# Altium schematic sheet Sheet2.SchDoc
size A3; SheetNumber: 1; SheetTotal: 2
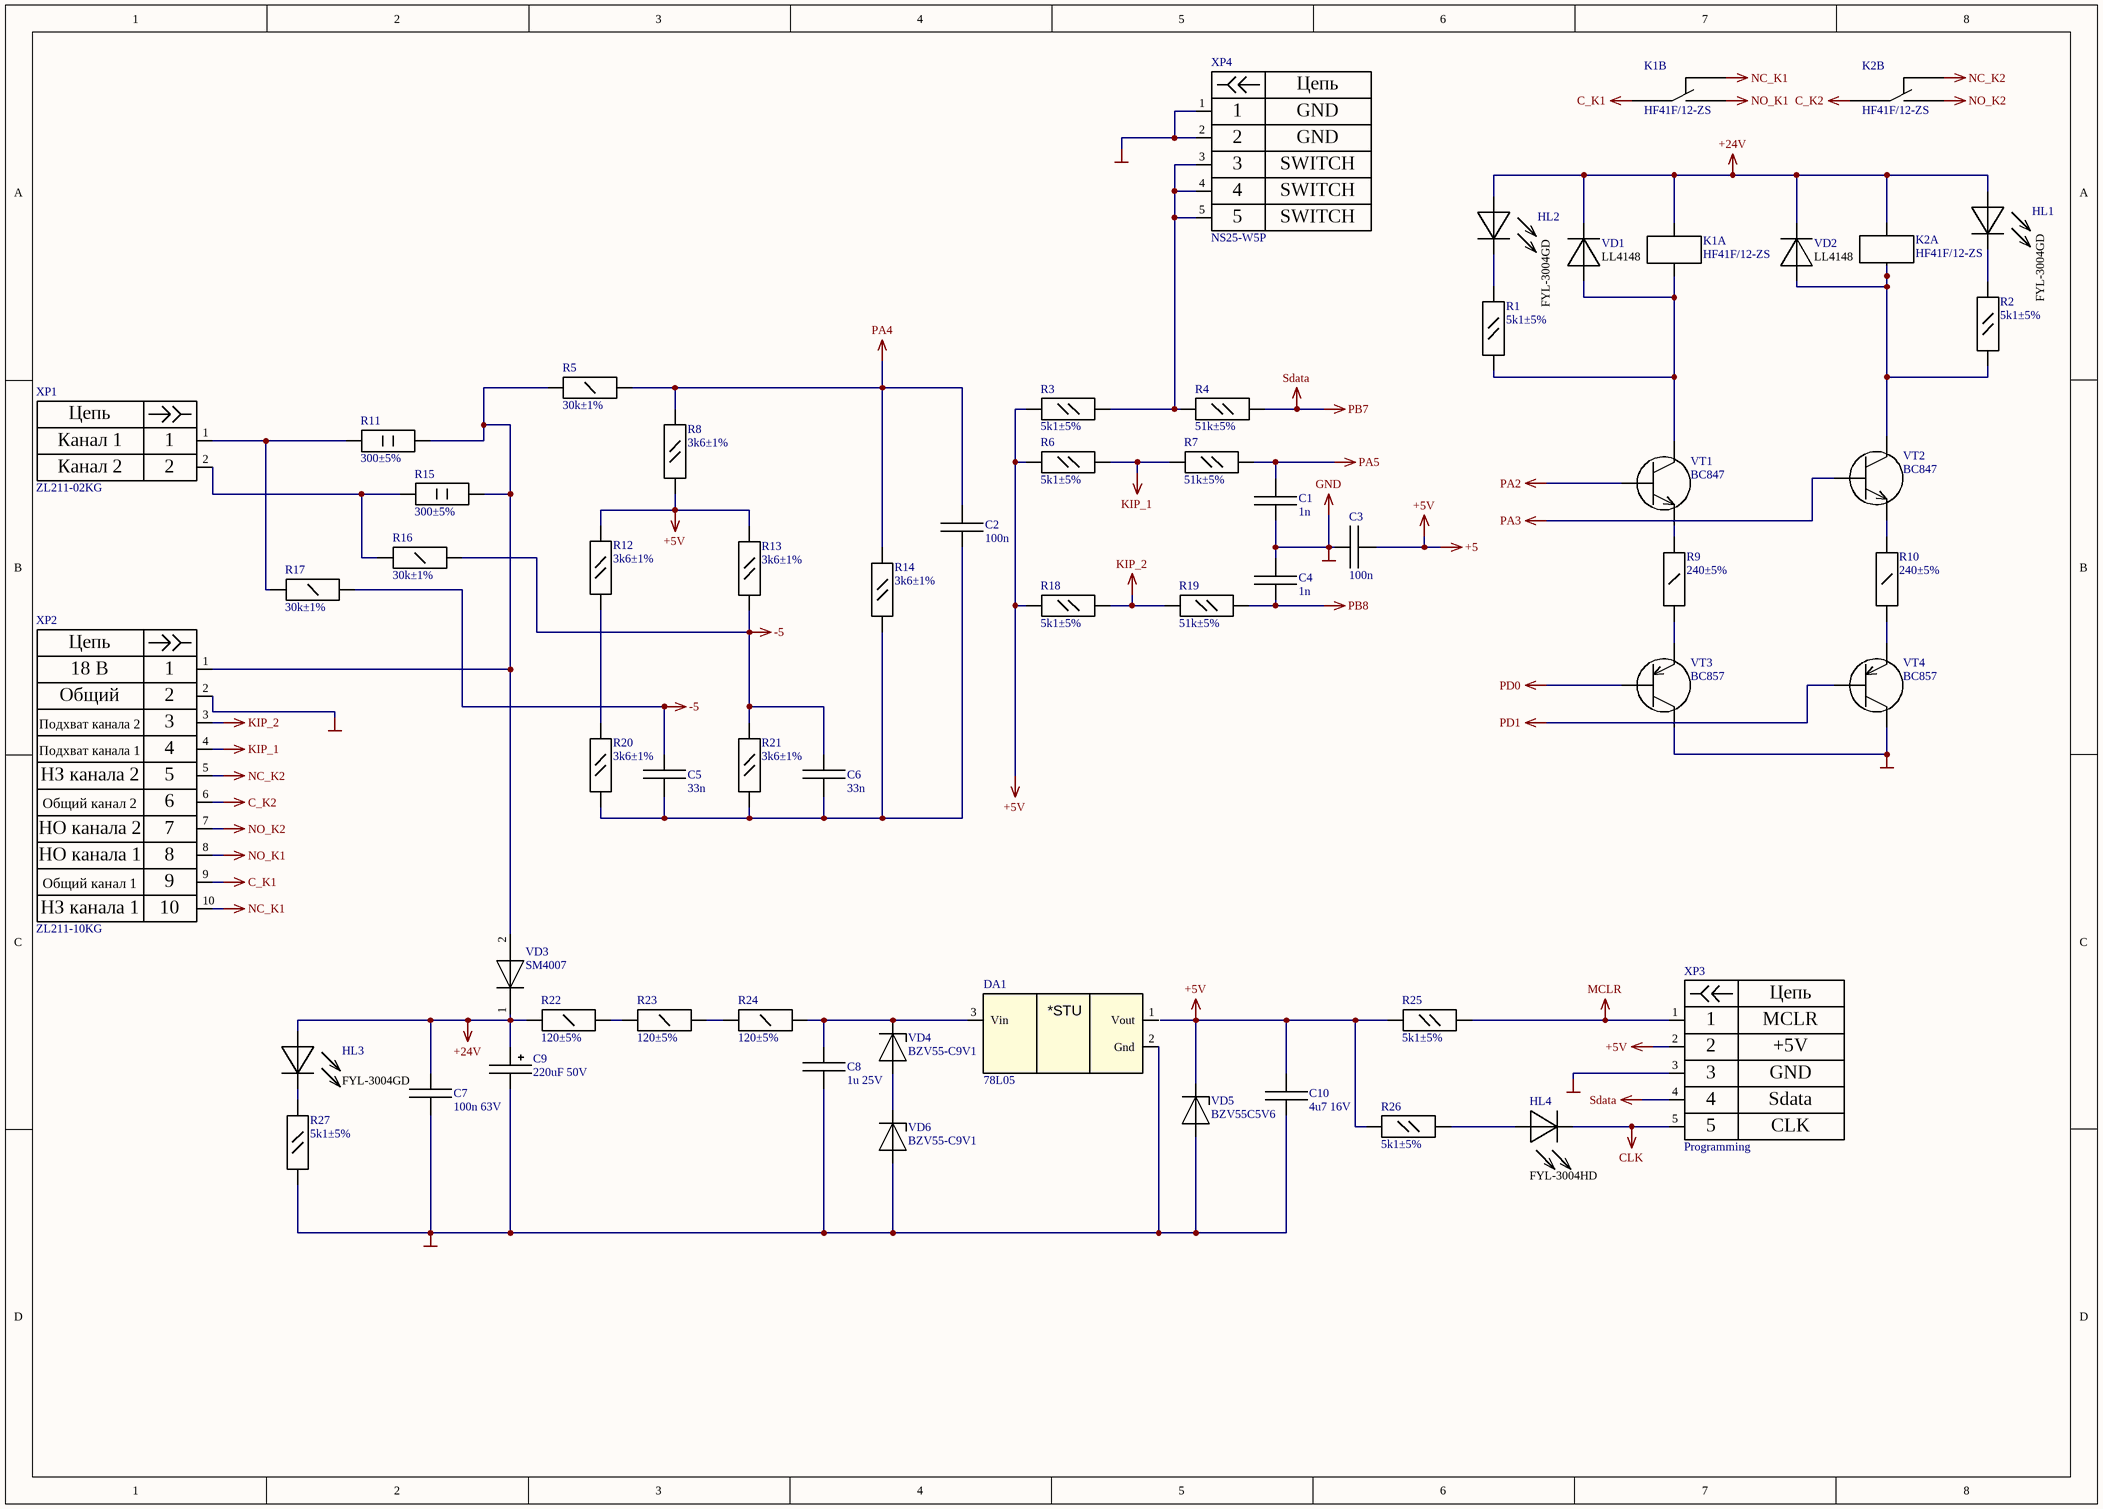
[diagram p0: Sheet2.SchDoc]

## Parts
C1  1n  [Cap Ceramic 0805]
C2  100n  [Cap Ceramic 0805]
C3  100n  [Cap Ceramic 0805]
C4  1n  [Cap Ceramic 0805]
C5  33n  [Cap Ceramic 0805]
C6  33n  [Cap Ceramic 0805]
C7  100n 63V  [Cap Ceramic 0805]
C8  1u 25V  [Cap Ceramic 0805]
C9  220uF 50V  [Cap electro d5x2.05mm]
C10  4u7 16V  [Cap Ceramic 0805]
DA1  78L05  [SOT-89]
HL1  FYL-3004GD  [LED 0805]
HL2  FYL-3004GD  [LED 0805]
HL3  FYL-3004GD  [LED 0805]
HL4  FYL-3004HD  [LED 0805]
K1  HF41F/12-ZS  [HF41F_12-ZS]  (parts A,B of 2)
K2  HF41F/12-ZS  [HF41F_12-ZS]  (parts A,B of 2)
R1  5k1±5%  [Resistor 0805]
R2  5k1±5%  [Resistor 0805]
R3  5k1±5%  [Resistor 0805]
R4  51k±5%  [Resistor 0805]
R5  30k±1%  [Resistor 1206]
R6  5k1±5%  [Resistor 0805]
R7  51k±5%  [Resistor 0805]
R8  3k6±1%  [Resistor 0805]
R9  240±5%  [Resistor 1206]
R10  240±5%  [Resistor 1206]
R11  300±5%  [Resistor 2W d5.08x20.32 axial]
R12  3k6±1%  [Resistor 0805]
R13  3k6±1%  [Resistor 0805]
R14  3k6±1%  [Resistor 0805]
R15  300±5%  [Resistor 2W d5.08x20.32 axial]
R16  30k±1%  [Resistor 1206]
R17  30k±1%  [Resistor 1206]
R18  5k1±5%  [Resistor 0805]
R19  51k±5%  [Resistor 0805]
R20  3k6±1%  [Resistor 0805]
R21  3k6±1%  [Resistor 0805]
R22  120±5%  [Resistor 1206]
R23  120±5%  [Resistor 1206]
R24  120±5%  [Resistor 1206]
R25  5k1±5%  [Resistor 0805]
R26  5k1±5%  [Resistor 0805]
R27  5k1±5%  [Resistor 0805]
VD1  LL4148  [SOD80C]
VD2  LL4148  [SOD80C]
VD3  SM4007  [SM4007]
VD4  BZV55-C9V1  [BZV55C9V1]
VD5  BZV55C5V6  [BZV55C5V6]
VD6  BZV55-C9V1  [BZV55C9V1]
VT1  BC847  [SOT-23-3]
VT2  BC847  [SOT-23-3]
VT3  BC857  [SOT-23-3]
VT4  BC857  [SOT-23-3]
XP1  ZL211-02KG  Name1: Канал 1  Name: Цепь  Name2: Канал 2  [Pins 1x2]
XP2  ZL211-10KG  Name1: 18 В  Name2: Общий  Name3: Подхват канала 2  Name: Цепь  Name4: Подхват канала 1  Name5: НЗ канала 2  Name6: Общий канал 2  Name7: НО канала 2  Name8: НО канала 1  Name9: Общий канал 1  Name10: НЗ канала 1  [Pins 1x10]
XP3  Programming  Name1: MCLR  Name: Цепь  Name2: +5V  Name3: GND  Name4: Sdata  Name5: CLK  [WF-05]
XP4  NS25-W5P  Name1: GND  Name: Цепь  Name3: SWITCH  [WF-05]

## Nets
+5: C3.2 C10.2 R3.1 R6.1 R8.1 R12.2 R13.2 R18.1 R25.1 R26.1 VD5.9 XP3.2  [also labelled +5V]
+24V: C7.1 C9.2 HL1.1(A) HL2.1(A) HL3.1(A) K1.10 K2.10 R22.1 VD1.2(K) VD2.2(K) VD3.1
-5: C1.1 C3.1 C4.2 C5.1 C6.1 C7.2 C8.2 C9.1 C10.1 DA1.2(Gnd) R13.1 R16.2 R17.2 R21.2 R27.1 VD5.8 VD6.8 VT3.3(K) VT4.3(K) XP2.2 XP3.3 XP4.1 XP4.2  [also labelled GND]
C_K1: K1.14 XP2.9
C_K2: K2.14 XP2.6
CLK: HL4.2(K) XP3.5
KIP_1: R6.2 R7.1 XP2.4
KIP_2: R18.2 R19.1 XP2.3
MCLR: R25.2 XP3.1
NC_K1: K1.12 XP2.10
NC_K2: K2.12 XP2.5
NO_K1: K1.13 XP2.8
NO_K2: K2.13 XP2.7
PA2: VT1.1(B)
PA3: VT2.1(B)
PA4: C2.2 R5.2 R8.2 R14.2
PA5: C1.2 R7.2
PB7: R4.2 XP3.4  [also labelled Sdata]
PB8: C4.1 R19.2
PD0: VT3.1(B)
PD1: VT4.1(B)
NetC2_1: C2.1 C5.2 C6.2 R14.1 R20.1 R21.1
NetC8_1: C8.1 DA1.3(Vin) R24.2 VD4.9
NetHL1_2: HL1.2(K) R2.2
NetHL2_2: HL2.2(K) R1.2
NetHL3_2: HL3.2(K) R27.2
NetHL4_1: HL4.1(A) R26.2
NetK1_11: K1.11 R1.1 VD1.1(A) VT1.3(K)
NetK2_11: K2.11 R2.1 VD2.1(A) VT2.3(K)
NetR3_2: R3.2 R4.1 XP4.3 XP4.4 XP4.5
NetR5_1: R5.1 R11.2 R15.2 VD3.2 XP2.1
NetR9_1: R9.1 VT3.2(E)
NetR9_2: R9.2 VT1.2(E)
NetR10_1: R10.1 VT4.2(E)
NetR10_2: R10.2 VT2.2(E)
NetR11_1: R11.1 R17.1 XP1.1
NetR12_1: R12.1 R20.2
NetR15_1: R15.1 R16.1 XP1.2
NetR22_2: R22.2 R23.1
NetR23_2: R23.2 R24.1
NetVD4_8: VD4.8 VD6.9

Not connected (* = marked no-connect by the designer): DA1 1(Vout)

## Notes on the sheet
- (in symbol 78L05) *STU

## Library data of the parts
C1-C8 C10 = CerCap: Comments: *
C9 = ECap: Comments: *
HL1-HL4 = LED: Comments: *
K1 K2 = HF41F_12-ZS
R1-R4 R6-R8 R12-R14 R18-R21 R25-R27 = Resistor 0,125W: Comments: *
R5 R16 R17 = Resistor 0.5W
R9 R10 R22-R24 = Resistor 0,25W: Comments: *
R11 R15 = Resistor 2W: Comments: *
VD4 VD6 = BZV55C9V1
XP1 = Pins 1x2: Comments: *
XP2 = Pins 1x10: Comments: *
XP3 XP4 = Pins 1x5: Comments: *
  XP4: Name2: GND; Name4: SWITCH; Name5: SWITCH
DA1 = 78L05: Comments: *
VD1 VD2 = LL4148: Comments: *
VT1 VT2 = BC847: Comments: *
VT3 VT4 = BC857: Comments: *